# Altium project oai_cm_ext.PrjPcb
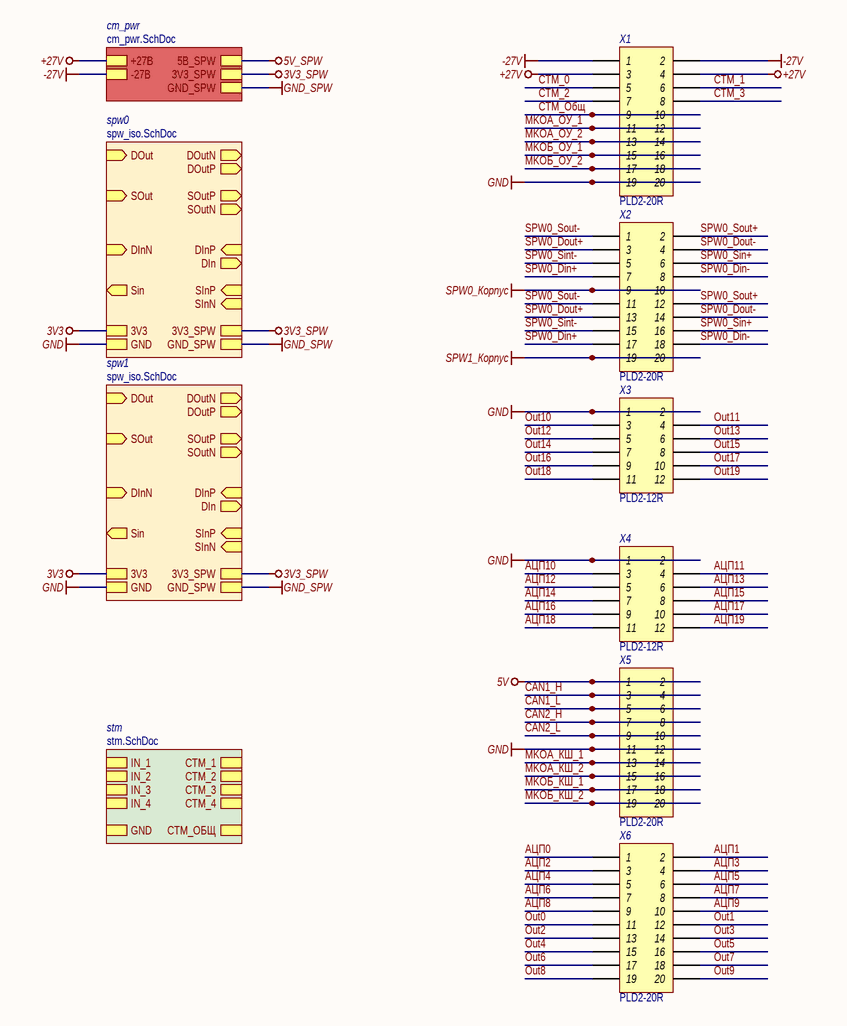
[diagram p0: oai_cm_main.SchDoc]
GlobalProjectName: ОАИ ЦМ; GlobalProjectRevision: 0.0
6 sheets, 64 parts. Net scope: hierarchical (ports join the sheet entries above them; power ports are global).
Board file: oai_cm_ext.PcbDoc
Sheets:
  oai_cm_main.SchDoc
    spw0 = spw_iso.SchDoc
    cm_pwr = cm_pwr.SchDoc
      spw_dc-dc = pwr_dc-dc.SchDoc
      lr1 = lin_reg.SchDoc
    stm = stm.SchDoc
    spw1 = spw_iso.SchDoc

## Sheet oai_cm_main.SchDoc: =GlobalProjectName
size 209 x 297 mm; Revision: 0.0; SheetNumber: 1; SheetTotal: 6; PageSetup: Record=PageOptions|CenterHorizontal=True|CenterVertical=True|PrintScale=1.00|XCorrection=1.00|YCorrection=1.00|PrintKind=1|BorderSize=5000000|LeftOffset=0|BottomOffset=0|Orientation=2|PaperLength=1000|PaperWidth=1000|Scale=100|PaperSource=15|PrintQuality=1200|MediaType=1|DitherType=10|PaperKind=A3|PrintScaleMode=1; Weight: -; ScaleFactor: -; DocumentName: ОАИ ЦМ

### Parts
X1  Header 2X20  [PLD2-20R]  (value not drawn)
X2  Header 2X20  [PLD2-20R]  (value not drawn)
X3  Header 2X12  [PLD2-12R]  (value not drawn)
X4  Header 2X12  [PLD2-12R]  (value not drawn)
X5  Header 2X20  [PLD2-20R]  (value not drawn)
X6  Header 2X20  [PLD2-20R]  (value not drawn)

### Sub-sheets
cm_pwr = cm_pwr.SchDoc: +27В, -27В, 5В_SPW, 3V3_SPW, GND_SPW
spw0 = spw_iso.SchDoc: DOutN (out), DOutP (out), SOutP (out), SInP (in), DOut (in), SInN (in), SOutN (out), DIn (out), DInN (in), DInP (in), SOut (in), Sin (out), GND, 3V3, 3V3_SPW, GND_SPW
spw1 = spw_iso.SchDoc: DOutN (out), DOutP (out), SOutP (out), SInP (in), DOut (in), SInN (in), SOutN (out), DIn (out), DInN (in), DInP (in), SOut (in), Sin (out), GND, 3V3, 3V3_SPW, GND_SPW
stm = stm.SchDoc: СТМ_4, IN_3, GND, СТМ_3, СТМ_1, IN_4, IN_2, IN_1, СТМ_ОБЩ, СТМ_2

### Nets
3V3: sheet spw0/3V3, sheet spw1/3V3
3V3_SPW: sheet spw0/3V3_SPW, sheet cm_pwr/3V3_SPW, sheet spw1/3V3_SPW  [project net 3V3]
5V: X5.1 X5.2
+27V: X1.3 X1.4 ; sheet cm_pwr/+27В  [project net +V_IN]
-27V: X1.1 X1.2 X1.19 X1.20 X3.1 X3.2 X4.1 X4.2 X5.11 X5.12 ; sheet spw0/GND, sheet cm_pwr/-27В, sheet stm/GND, sheet spw1/GND  [also labelled GND]  [project net -V_IN]
GND_SPW: sheet spw0/GND_SPW, sheet cm_pwr/GND_SPW, sheet spw1/GND_SPW
SPW0_Корпус: X2.9 X2.10
SPW1_Корпус: X2.19 X2.20
CAN1_H: X5.3 X5.4
CAN1_L: X5.5 X5.6
CAN2_H: X5.7 X5.8
CAN2_L: X5.9 X5.10
MKOА_КШ_1: X5.13 X5.14
MKOА_КШ_2: X5.15 X5.16
MKOА_ОУ_1: X1.11 X1.12
MKOА_ОУ_2: X1.13 X1.14
MKOБ_КШ_1: X5.17 X5.18
MKOБ_КШ_2: X5.19 X5.20
MKOБ_ОУ_1: X1.15 X1.16
MKOБ_ОУ_2: X1.17 X1.18
Out0: X6.11
Out1: X6.12
Out2: X6.13
Out3: X6.14
Out4: X6.15
Out5: X6.16
Out6: X6.17
Out7: X6.18
Out8: X6.19
Out9: X6.20
Out10: X3.3
Out11: X3.4
Out12: X3.5
Out13: X3.6
Out14: X3.7
Out15: X3.8
Out16: X3.9
Out17: X3.10
Out18: X3.11
Out19: X3.12
SPW0_Din+: X2.7 X2.17
SPW0_Din-: X2.8 X2.18
SPW0_Dout+: X2.3 X2.13
SPW0_Dout-: X2.4 X2.14
SPW0_Sin+: X2.6 X2.16
SPW0_Sint-: X2.5 X2.15
SPW0_Sout+: X2.2 X2.12
SPW0_Sout-: X2.1 X2.11
АЦП0: X6.1
АЦП1: X6.2
АЦП2: X6.3
АЦП3: X6.4
АЦП4: X6.5
АЦП5: X6.6
АЦП6: X6.7
АЦП7: X6.8
АЦП8: X6.9
АЦП9: X6.10
АЦП10: X4.3
АЦП11: X4.4
АЦП12: X4.5
АЦП13: X4.6
АЦП14: X4.7
АЦП15: X4.8
АЦП16: X4.9
АЦП17: X4.10
АЦП18: X4.11
АЦП19: X4.12
СТМ_0: X1.5
СТМ_1: X1.6
СТМ_2: X1.7
СТМ_3: X1.8
СТМ_Общ: X1.9 X1.10

### Notes on the sheet
- Перв. примен.
- Справ. №
- Подп. и дата
- Инв. № дубл.
- Взам. инв. №
- Разраб.
- Изм.
- Лист
- № докум.
- Подп.
- Дата
- Литера
- Масса
- Масштаб
- Пров.
- Т.контр.
- Листов
- Инв. № подл.
- Н.контр.
- Утв.
- Форма 1 ГОСТ 2.104-2006
- Копировал
- Формат А4

### Library data of the parts
X1 X2 X5 X6 = Header 2X20: Header, 20-Pin, Dual row; Потребление, Вт: 0,0; Назначение: Header, 20-Pin, Dual row; Наименование: PLD2-20R
X3 X4 = Header 2X12: Header, 12-Pin, Dual row; Потребление, Вт: 0,0; Назначение: Header, 12-Pin, Dual row; Наименование: PLD2-12R

## Sheet spw_iso.SchDoc
size 209 x 297 mm; SheetNumber: 11; SheetTotal: 12
Used 2 times, as channels spw0, spw1. Parts and nets are listed once, with the designators drawn on the sheet.
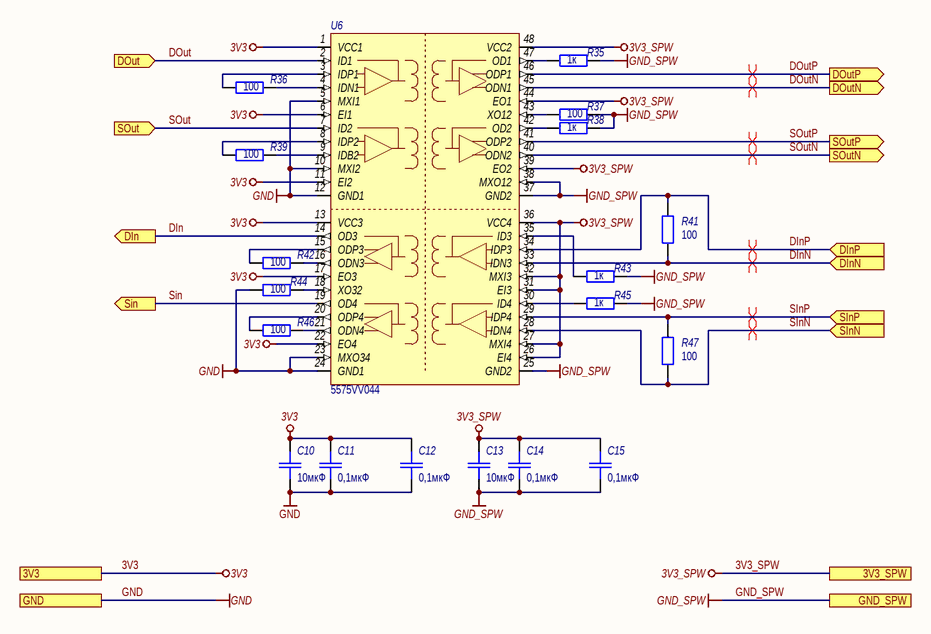
[diagram p1: spw_iso.SchDoc]

### Parts
C10  10мкФ  [SMD_C0805]
C11  0,1мкФ  [SMD_C0805]
C12  0,1мкФ  [SMD_C0805]
C13  10мкФ  [SMD_C0805]
C14  0,1мкФ  [SMD_C0805]
C15  0,1мкФ  [SMD_C0805]
R35  1к  [SMD_0805]
R36  100  [SMD_0805]
R37  100  [SMD_0805]
R38  1к  [SMD_0805]
R39  100  [SMD_0805]
R41  100  [SMD_0805]
R42  100  [SMD_0805]
R43  1к  [SMD_0805]
R44  100  [SMD_0805]
R45  1к  [SMD_0805]
R46  100  [SMD_0805]
R47  100  [SMD_0805]
U6  5575VV044  [MK 4159.48-1]

### Ports
3V3, 3V3_SPW, DIn (out), DInN (in), DInP (in), DOut (in), DOutN (out), DOutP (out), GND, GND_SPW, Sin (out), SInN (in), SInP (in), SOut (in), SOutN (out), SOutP (out)

### Nets
3V3: C10.2 C11.2 C12.2 U6.1(VCC1) U6.6(EI1) U6.11(EI2) U6.13(VCC3) U6.17(EO3) U6.22(EO4) ; port 3V3
3V3_SPW: C13.2 C14.2 C15.2 U6.26(EI4) U6.27(MXI4) U6.31(EI3) U6.32(MXI3) U6.36(VCC4) U6.39(EO2) U6.44(EO1) U6.48(VCC2) ; port 3V3_SPW
GND: C10.1 C11.1 C12.1 R44.2 U6.5(MXI1) U6.10(MXI2) U6.12(GND1) U6.23(MXO34) U6.24(GND1) ; port GND
GND_SPW: C13.1 C14.1 C15.1 R35.2 R37.2 R38.2 R43.2 R45.2 U6.25(GND2) U6.37(GND2) U6.38(MXO12) ; port GND_SPW
DIn: U6.14(OD3) ; port DIn
DInN: R41.1 U6.33(IDN3) ; port DInN
DInP: R41.2 U6.34(IDP3) ; port DInP
DOut: U6.2(ID1) ; port DOut
DOutN: U6.45(ODN1) ; port DOutN
DOutP: U6.46(ODP1) ; port DOutP
Sin: U6.19(OD4) ; port Sin
SInN: R47.1 U6.28(IDN4) ; port SInN
SInP: R47.2 U6.29(IDP4) ; port SInP
SOut: U6.7(ID2) ; port SOut
SOutN: U6.40(ODN2) ; port SOutN
SOutP: U6.41(ODP2) ; port SOutP
NetR35_1: R35.1 U6.47(OD1)
NetR36_1: R36.1 U6.4(IDN1)
NetR36_2: R36.2 U6.3(IDP1)
NetR37_1: R37.1 U6.43(XO12)
NetR38_1: R38.1 U6.42(OD2)
NetR39_1: R39.1 U6.9(IDB2)
NetR39_2: R39.2 U6.8(IDP2)
NetR42_1: R42.1 U6.16(ODN3)
NetR42_2: R42.2 U6.15(ODP3)
NetR43_1: R43.1 U6.35(ID3)
NetR44_1: R44.1 U6.18(XO32)
NetR45_1: R45.1 U6.30(ID4)
NetR46_1: R46.1 U6.21(ODN4)
NetR46_2: R46.2 U6.20(ODP4)

### Channels
spw0: designators end in _spw0; ports 3V3=3V3 3V3_SPW=3V3 DIn=DIn_spw0 DInN=DInN_spw0 DInP=DInP_spw0 DOut=DOut_spw0 DOutN=DOutN_spw0 DOutP=DOutP_spw0 GND=-V_IN GND_SPW=GND_SPW Sin=Sin_spw0 SInN=SInN_spw0 SInP=SInP_spw0 SOut=SOut_spw0 SOutN=SOutN_spw0 SOutP=SOutP_spw0
spw1: designators end in _spw1; ports 3V3=3V3 3V3_SPW=3V3 DIn=DIn_spw1 DInN=DInN_spw1 DInP=DInP_spw1 DOut=DOut_spw1 DOutN=DOutN_spw1 DOutP=DOutP_spw1 GND=-V_IN GND_SPW=GND_SPW Sin=Sin_spw1 SInN=SInN_spw1 SInP=SInP_spw1 SOut=SOut_spw1 SOutN=SOutN_spw1 SOutP=SOutP_spw1

### Layout directives
differential pair: DInN_spw0, DInP_spw0, DOutN_spw0, DOutP_spw0, SInN_spw0, SInP_spw0, SOutN_spw0, SOutP_spw0

### Notes on the sheet
- Подп. и дата
- Инв. № дубл.
- Взам. инв. №
- Инв. № подл.
- Изм.
- Лист
- № докум.
- Подп.
- Дата
- Форма 2а ГОСТ 2.104-2006
- Копировал
- Формат А4

### Library data of the parts
C10-C15 = Capacitor: Назначение: SMD-конденсатор; Наименование: К10-79 МП0 «ВП»; Потребление, Вт: 0
  C10 C13: Value: 10мкФ
  C11 C12 C14 C15: Value: 0,1мкФ
R35-R39 R41-R47 = Resistor: Наименование: Резистор; Назначение: SMD-резистор; Потребление, Вт: 0,001
  R35 R38 R43 R45: Value: 1к
  R36 R37 R39 R41 R42 R44 R46 R47: Value: 100
U6 = 5575BB044: Микросхема гальванической развязки цифровых сигналов; Потребление, Вт: 0.165; Назначение: Микросхема гальванической развязки цифровых сигналов; Наименование: 5575BB044; ComponentLink1Description: DataSheet; ComponentLink1URL: http://www.asic.ru/images/stories/bmk/5575/5575BB_Opisanie.pdf

## Sheet cm_pwr.SchDoc
size 209 x 297 mm; SheetNumber: 3; SheetTotal: 12
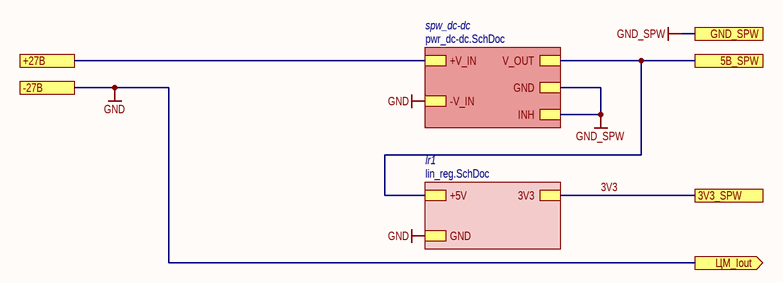
[diagram p2: cm_pwr.SchDoc]

### Sub-sheets
lr1 = lin_reg.SchDoc: 3V3, GND, +5V
spw_dc-dc = pwr_dc-dc.SchDoc: GND, INH, V_OUT, -V_IN, +V_IN

### Ports
3V3_SPW, 5В_SPW, +27В, -27В, GND_SPW, ЦМ_Iout (out)

### Nets
3V3: port 3V3_SPW, sheet lr1/3V3
5V_SPW: port 5В_SPW, sheet spw_dc-dc/V_OUT, sheet lr1/+5V
+V_IN: port +27В, sheet spw_dc-dc/+V_IN
GND: port -27В, port ЦМ_Iout, sheet spw_dc-dc/-V_IN, sheet lr1/GND  [project net -V_IN]
GND_SPW: port GND_SPW, sheet spw_dc-dc/GND, sheet spw_dc-dc/INH

### Notes on the sheet
- Подп. и дата
- Инв. № дубл.
- Взам. инв. №
- Инв. № подл.
- Изм.
- Лист
- № докум.
- Подп.
- Дата
- Форма 2а ГОСТ 2.104-2006
- Копировал
- Формат А4

## Sheet pwr_dc-dc.SchDoc: =GlobalProjectName
size 209 x 297 mm; Revision: 0.0; SheetNumber: 4; SheetTotal: 7; PageSetup: Record=PageOptions|CenterHorizontal=True|CenterVertical=True|PrintScale=1.00|XCorrection=1.00|YCorrection=1.00|PrintKind=1|BorderSize=5000000|LeftOffset=0|BottomOffset=0|Orientation=2|PaperLength=1000|PaperWidth=1000|Scale=100|PaperSource=15|PrintQuality=1200|MediaType=1|DitherType=10|PaperKind=A3|PrintScaleMode=1; Weight: -; ScaleFactor: -; DocumentName: ОАИ ЦМ
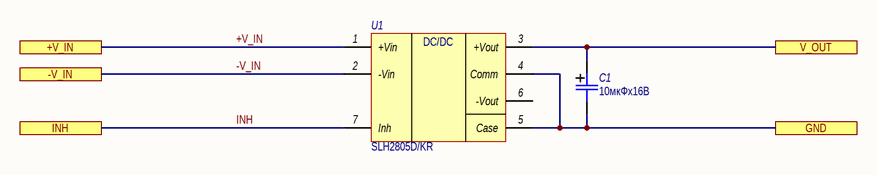
[diagram p3: pwr_dc-dc.SchDoc]

### Parts
C1  10мкФх16В  [SMD_size_B]
U1  Наименование: SLH2805D/KR  [SLH28xx]  (hidden comment: SLH28xx)

### Ports
+V_IN, -V_IN, GND, INH, V_OUT

### Nets
5V_SPW: C1.1 U1.3(+Vout) ; port V_OUT
+V_IN: U1.1(+Vin) ; port +V_IN
-V_IN: U1.2(-Vin) ; port -V_IN
INH: C1.2 U1.4(Comm) U1.5(Case) U1.7(Inh) ; port GND, port INH  [project net GND_SPW]

Not connected (* = marked no-connect by the designer): U1 6(-Vout)

### Notes on the sheet
- Подп. и дата
- Инв. № дубл.
- Взам. инв. №
- Инв. № подл.
- Изм.
- Лист
- № докум.
- Подп.
- Дата
- Форма 2а ГОСТ 2.104-2006
- Копировал
- Формат А4
- (in symbol SLH28xx) DC/DC

### Library data of the parts
C1 = Capacitor_pol: Polarized capacitor; Назначение: Поляризованный SMD-конденсатор; Наименование: Поляризованный конденсатор; Потребление, Вт: 0; Value: 10мкФх16В
U1 = SLH28xx: DC-DC; Назначение: DC-DC преобразователь; Потребление, Вт: 0.1; ComponentLink1Description: DataSheet; ComponentLink1URL: https://www.interpoint.com/product_documents/SLH_Space_DC_DC_Converters.pdf

## Sheet lin_reg.SchDoc: =GlobalProjectName
size 209 x 297 mm; ApprovedBy: Утвердил; CheckedBy: Проверил; Author: Разработал; Revision: 0.0; SheetNumber: 5; SheetTotal: 7; PageSetup: Record=PageOptions|CenterHorizontal=True|CenterVertical=True|PrintScale=1.00|XCorrection=1.00|YCorrection=1.00|PrintKind=1|BorderSize=5000000|LeftOffset=0|BottomOffset=0|Orientation=2|PaperLength=1000|PaperWidth=1000|Scale=100|PaperSource=15|PrintQuality=1200|MediaType=1|DitherType=10|PaperKind=A3|PrintScaleMode=1; Weight: -; ScaleFactor: -; NormInspection: Норм.Контр.; DocumentName: ОАИ ЦМ
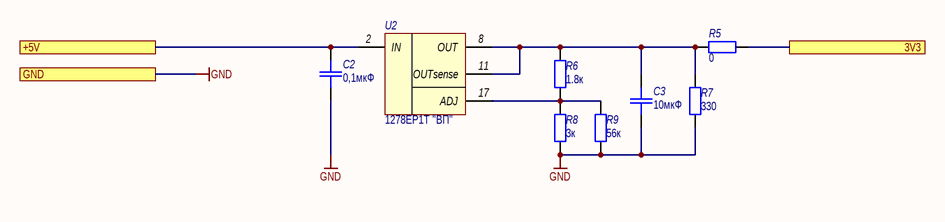
[diagram p4: lin_reg.SchDoc]

### Parts
(Parts that share a designator on the sheet are numbered #1, #2 ... from top to bottom, then left to right.)
C2  0,1мкФ  [SMD_0805]
C3  10мкФ  [SMD_0805]
R5  0  [SMD_0805]
R6#1  1.8к  [SMD_0805]
R7#1  330  [SMD_0805]
R8#1  3к  [SMD_0805]
R9#1  56к  [SMD_0805]
U2  Наименование: 1278ЕР1Т "ВП"  [4116.4-3_offcut]  (hidden comment: 1278ER1T VP)

### Ports
3V3, +5V, GND

### Nets
3V3: R5.1 ; port 3V3
5V_SPW: C2.2 U2.2(IN) ; port +5V
GND: C2.1 C3.1 R7#1.1 R8#1.1 R9#1.1 ; port GND  [project net -V_IN]
NetC3_2: C3.2 R5.2 R6#1.2 R7#1.2 U2.8(OUT) U2.11(OUTsense)
NetR6#1_1: R6#1.1 R8#1.2 R9#1.2 U2.17(ADJ)

### Notes on the sheet
- Подп. и дата
- Инв. № дубл.
- Взам. инв. №
- Инв. № подл.
- Изм.
- Лист
- № докум.
- Подп.
- Дата
- Форма 2а ГОСТ 2.104-2006
- Копировал
- Формат А4

### Library data of the parts
C2 C3 = Capacitor: as C10 on sheet spw_iso
  C2: Value: 0,1мкФ
  C3: Value: 10мкФ
R5 R6#1 R7#1 R8#1 R9#1 = Resistor: Наименование: Р1-12-0.125 ОСМ; Назначение: SMD-резистор; Потребление, Вт: 0,001
  R5: Value: 0
  R6#1: Value: 1.8к
  R7#1: Value: 330
  R8#1: Value: 3к
  R9#1: Value: 56к
U2 = 1278ER1T: Low-drop linear regulator; Назначение: Линейный регулятор; Потребление, Вт: 0,100; ComponentLink1Description: DataSheet; ComponentLink1URL: https://www.radiant.su/files/images/Kremhij-marketing/1278EP1T.pdf

## Sheet stm.SchDoc: =GlobalProjectName
size 209 x 297 mm; ApprovedBy: Утвердил; CheckedBy: Проверил; Author: Разработал; Revision: 0.0; SheetNumber: 5; SheetTotal: 8; PageSetup: Record=PageOptions|CenterHorizontal=True|CenterVertical=True|PrintScale=1.00|XCorrection=1.00|YCorrection=1.00|PrintKind=1|BorderSize=5000000|LeftOffset=0|BottomOffset=0|Orientation=2|PaperLength=1000|PaperWidth=1000|Scale=100|PaperSource=15|PrintQuality=1200|MediaType=1|DitherType=10|PaperKind=A3|PrintScaleMode=1; Weight: -; ScaleFactor: -; NormInspection: Норм.Контр.; DocumentName: ОАИ ЦМ
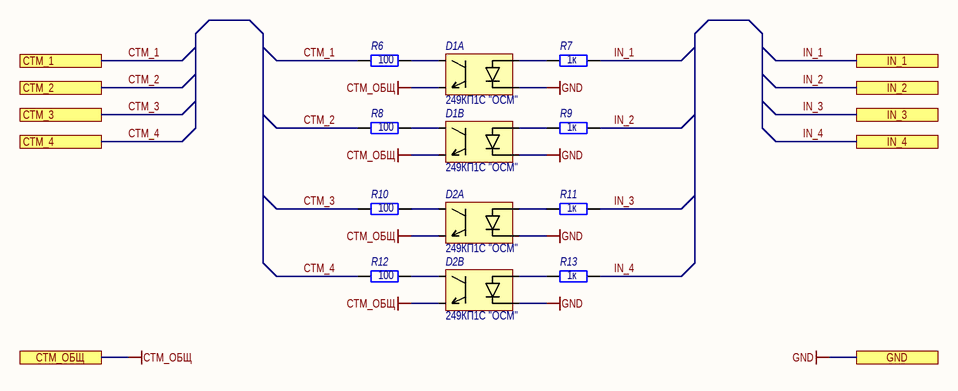
[diagram p5: stm.SchDoc]

### Parts
(Parts that share a designator on the sheet are numbered #1, #2 ... from top to bottom, then left to right.)
D1  Наименование: 249КП1C "ОСМ"  [401.14-4]  (hidden comment: 249KP1S OSM)  (parts A,B of 2)
D2  Наименование: 249КП1C "ОСМ"  [401.14-4]  (hidden comment: 249KP1S OSM)  (parts A,B of 2)
R6#2  100  [SMD_0805]
R7#2  1к  [SMD_0805]
R8#2  100  [SMD_0805]
R9#2  1к  [SMD_0805]
R10  100  [SMD_0805]
R11  1к  [SMD_0805]
R12  100  [SMD_0805]
R13  1к  [SMD_0805]

### Ports
GND, IN_1, IN_2, IN_3, IN_4, СТМ_1, СТМ_2, СТМ_3, СТМ_4, СТМ_ОБЩ

### Nets
GND: D1.3 D1.10 D2.3 D2.10 ; port GND  [project net -V_IN]
СТМ_ОБЩ: D1.6 D1.13 D2.6 D2.13 ; port СТМ_ОБЩ
IN_1: R7#2.2 ; port IN_1
IN_2: R9#2.2 ; port IN_2
IN_3: R11.2 ; port IN_3
IN_4: R13.2 ; port IN_4
СТМ_1: R6#2.1 ; port СТМ_1
СТМ_2: R8#2.1 ; port СТМ_2
СТМ_3: R10.1 ; port СТМ_3
СТМ_4: R12.1 ; port СТМ_4
NetD1_2: D1.2 R7#2.1
NetD1_4: D1.4 R8#2.2
NetD1_9: D1.9 R9#2.1
NetD1_11: D1.11 R6#2.2
NetD2_2: D2.2 R11.1
NetD2_4: D2.4 R12.2
NetD2_9: D2.9 R13.1
NetD2_11: D2.11 R10.2

### Notes on the sheet
- Подп. и дата
- Инв. № дубл.
- Взам. инв. №
- Инв. № подл.
- Изм.
- Лист
- № докум.
- Подп.
- Дата
- Форма 2а ГОСТ 2.104-2006
- Копировал
- Формат А4

### Library data of the parts
D1 D2 = 249KP1: Транзисторная оптопара; Потребление, Вт: 0,005; Назначение: Оптопара; ComponentLink1Description: DataSheet; ComponentLink1URL: https://eandc.ru/pdf/mikroskhema/249kp1.pdf
R6#2 R7#2 R8#2 R9#2 R10-R13 = Resistor: as R5 on sheet lin_reg
  R6#2 R8#2 R10 R12: Value: 100
  R7#2 R9#2 R11 R13: Value: 1к

## Nets that join several sheets
3V3: spw0 (9 pins), spw1 (9 pins)
3V3: spw0 (11 pins), lin_reg (R5.1), spw1 (11 pins)
5V_SPW: pwr_dc-dc (C1.1 U1.3), lin_reg (C2.2 U2.2)
+V_IN: oai_cm_main (X1.3 X1.4), pwr_dc-dc (U1.1)
-V_IN: oai_cm_main (10 pins), spw0 (9 pins), pwr_dc-dc (U1.2), lin_reg (5 pins), stm (D1.3 D1.10 D2.3 D2.10), spw1 (9 pins)
GND_SPW: spw0 (11 pins), pwr_dc-dc (C1.2 U1.4 U1.5 U1.7), spw1 (11 pins)